# EAGLE design MainBoard (EAGLE 8.3.2)
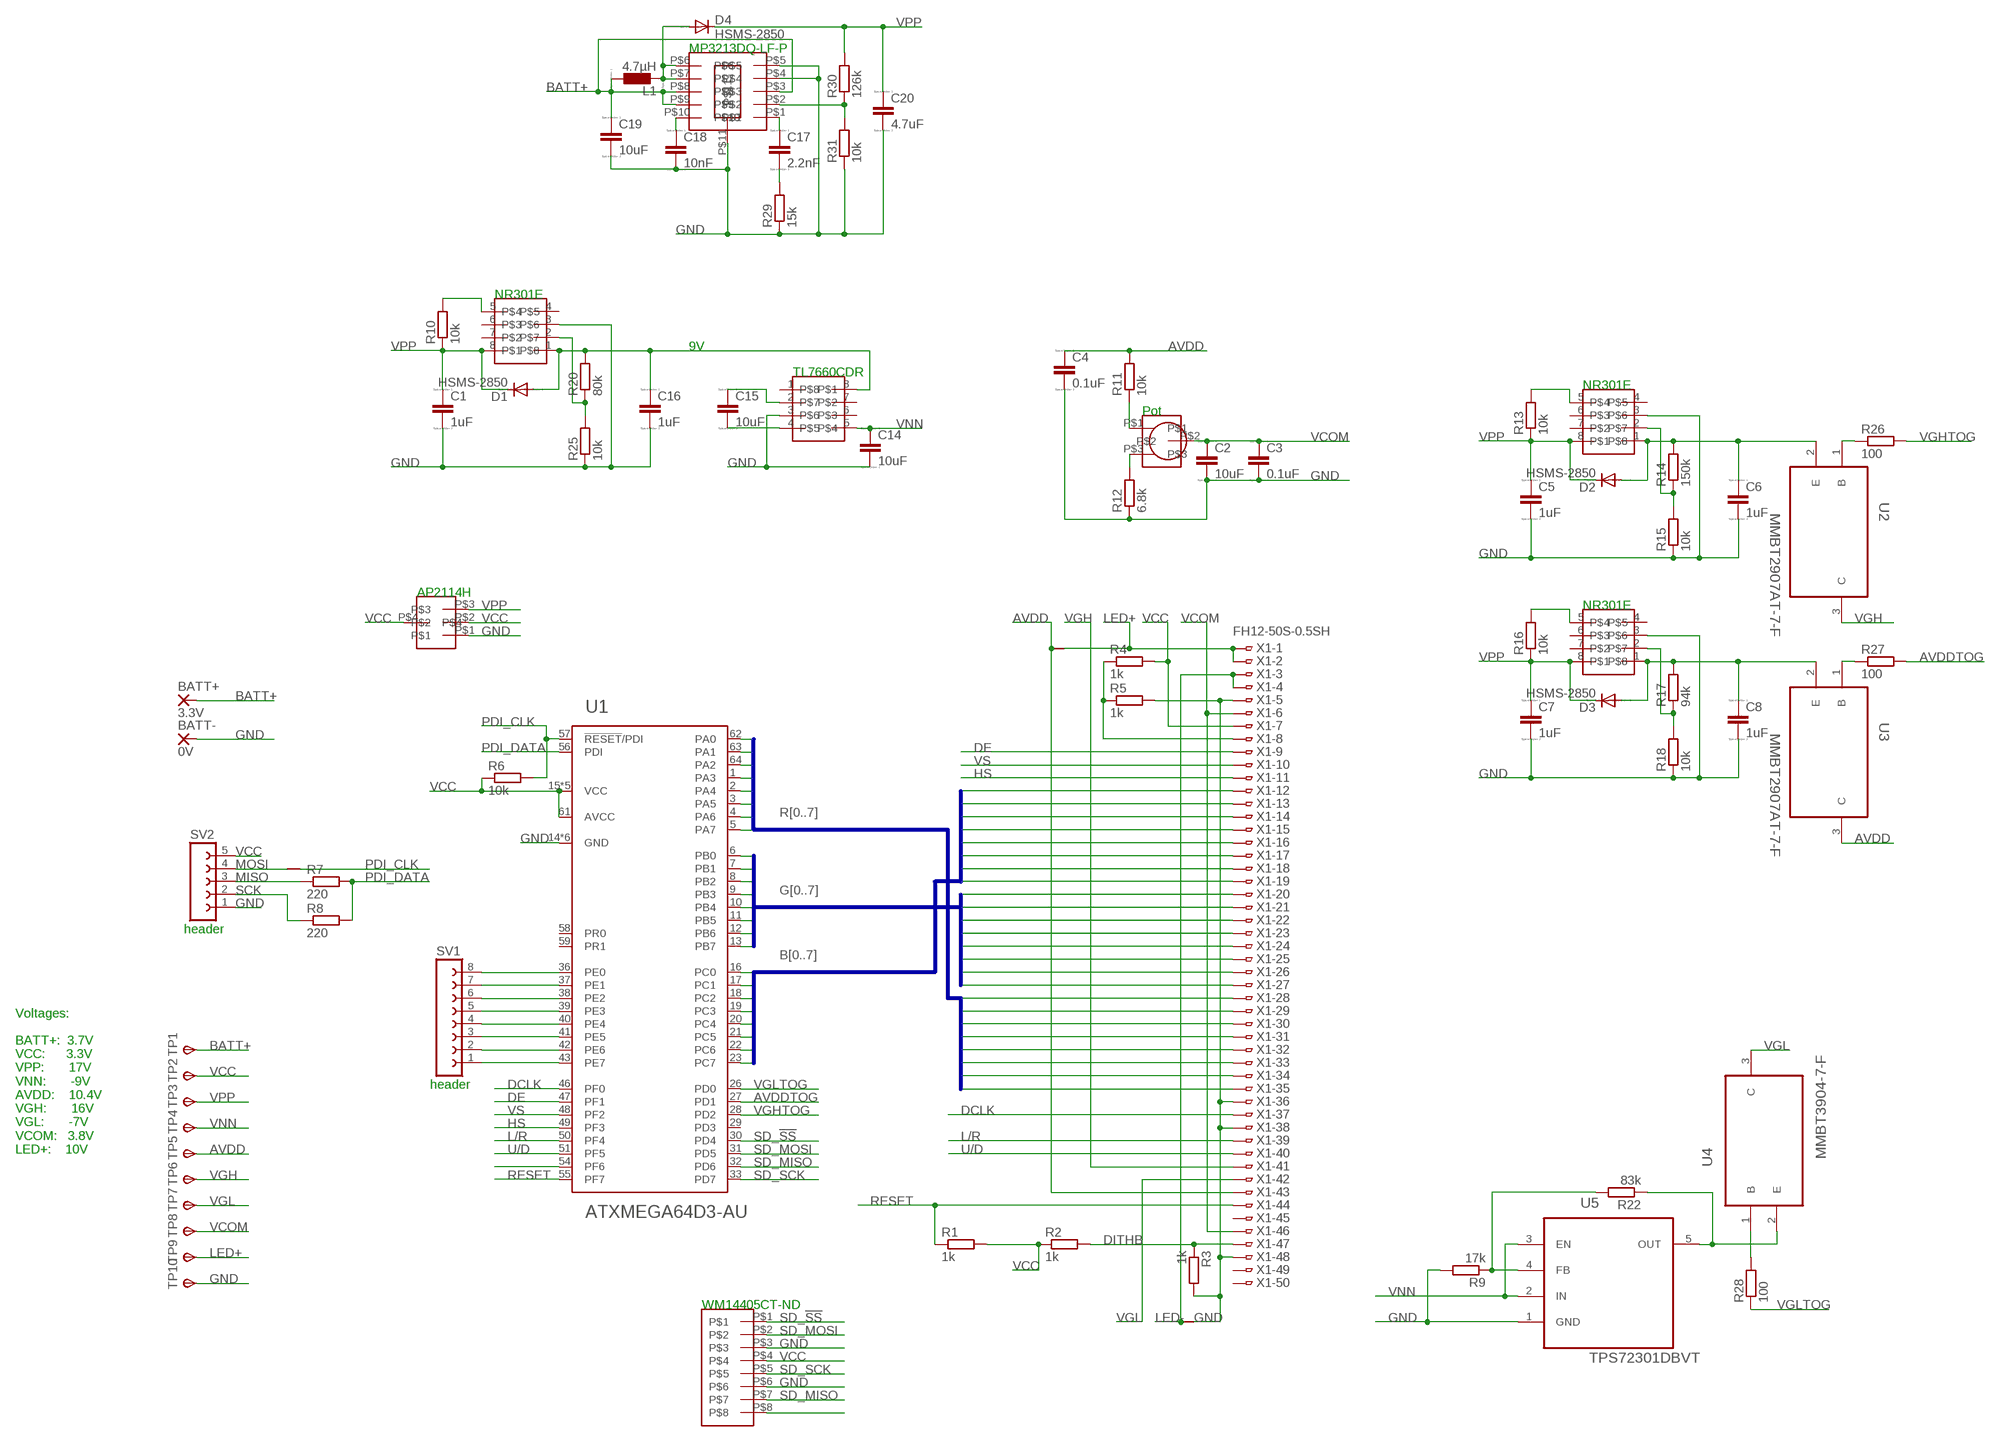
[diagram p0: schematic, sheet 1]

## Parts
AP2114H  AP2114H  [SOT233]
BATT+  3.3V  2,54/1,1  [2,54/1,1]
BATT-  0V  2,54/1,1  [2,54/1,1]
C1  1uF  CC0402  [C0402]
C2  10uF  CC0402  [C0402]
C3  0.1uF  CC0402  [C0402]
C4  0.1uF  CC0402  [C0402]
C5  1uF  CC0402  [C0402]
C6  1uF  CC0402  [C0402]
C7  1uF  CC0402  [C0402]
C8  1uF  CC0402  [C0402]
C14  10uF  CC0402  [C0402]
C15  10uF  CC0402  [C0402]
C16  1uF  CC0402  [C0402]
C17  2.2nF  CC0402  [C0402]
C18  10nF  CC0402  [C0402]
C19  10uF  CC0402  [C0402]
C20  4.7uF  CC0402  [C0402]
D1  HSMS-2850  [SOT23]
D2  HSMS-2850  [SOT23]
D3  HSMS-2850  [SOT23]
D4  HSMS-2850  [SOT23]
L1  4.7µH  L  [L1812]
R1  1k  R-EU_M1406  [M1406]
R2  1k  R-EU_M1406  [M1406]
R3  1k  R-EU_M1406  [M1406]
R4  1k  R-EU_M1406  [M1406]
R5  1k  R-EU_M1406  [M1406]
R6  10k  R-EU_M1406  [M1406]
R7  220  R-EU_M1406  [M1406]
R8  220  R-EU_M1406  [M1406]
R9  17k  R-EU_M1406  [M1406]
R10  10k  R-EU_M1406  [M1406]
R11  10k  R-EU_M1406  [M1406]
R12  6.8k  R-EU_M1406  [M1406]
R13  10k  R-EU_M1406  [M1406]
R14  150k  R-EU_M1406  [M1406]
R15  10k  R-EU_M1406  [M1406]
R16  10k  R-EU_M1406  [M1406]
R17  94k  R-EU_M1406  [M1406]
R18  10k  R-EU_M1406  [M1406]
R20  80k  R-EU_M1406  [M1406]
R22  83k  R-EU_M1406  [M1406]
R25  10k  R-EU_M1406  [M1406]
R26  100  R-EU_M1406  [M1406]
R27  100  R-EU_M1406  [M1406]
R28  100  R-EU_M1406  [M1406]
R29  15k  R-EU_M1406  [M1406]
R30  126k  R-EU_M1406  [M1406]
R31  10k  R-EU_M1406  [M1406]
SV1  FE08-1  [FE08]
SV2  FE05-1  [FE05-1]
TP1  TPSPAD1-17Y  [P1-17Y]
TP2  TPSPAD1-17Y  [P1-17Y]
TP3  TPSPAD1-17Y  [P1-17Y]
TP4  TPSPAD1-17Y  [P1-17Y]
TP5  TPSPAD1-17Y  [P1-17Y]
TP6  TPSPAD1-17Y  [P1-17Y]
TP7  TPSPAD1-17Y  [P1-17Y]
TP8  TPSPAD1-17Y  [P1-17Y]
TP9  TPSPAD1-17Y  [P1-17Y]
TP10  TPSPAD1-17Y  [P1-17Y]
U1  ATXMEGA64D3-AU  [TQFP-64A-64]
U2  MMBT2907AT-7-F  [SOT65P210X110-3N]
U3  MMBT2907AT-7-F  [SOT65P210X110-3N]
U4  MMBT3904-7-F  [SOT103P240X110-3N]
U5  TPS72301DBVT  [SOT95P280X145-5N]
U$1  SHORT  [SHORT]
U$2  MICROSD  [MICROSD]
U$4  TRIMMER  [TRIMMMER]
U$5  NR301E  SOIC-8  [SOIC-8]
U$6  NR301E  SOIC-8  [SOIC-8]
U$8  SHORT  [SHORT]
U$9  SHORT  [SHORT]
U$10  SOIC-8  [SOIC-8]
U$11  NR301E  SOIC-8  [SOIC-8]
U$12  QFN-10  [QFN-10]
X1  FH12-50S-0.5SH  [FH12-50S-0.5SH]

## Nets
AVDD: C4.1 R11.2 TP5.TP(PP) U3.3(C) U$8.P$1 X1.43
AVDDTOG: R27.2 U1.27(PD1)
B0: U1.16(PC0) X1.19
B1: U1.17(PC1) X1.18
B2: U1.18(PC2) X1.17
B3: U1.19(PC3) X1.16
B4: U1.20(PC4) X1.15
B5: U1.21(PC5) X1.14
B6: U1.22(PC6) X1.13
B7: U1.23(PC7) X1.12
BATT+: BATT+.1(P) C19.1 L1.1 TP1.TP(PP) U$12.P$3 U$12.P$8 U$12.P$9
DCLK: U1.46(PF0) X1.37
DE: U1.47(PF1) X1.9
DITHB: R2.2 R3.1 X1.47
G0: U1.6(PB0) X1.27
G1: U1.7(PB1) X1.26
G2: U1.8(PB2) X1.25
G3: U1.9(PB3) X1.24
G4: U1.10(PB4) X1.23
G5: U1.11(PB5) X1.22
G6: U1.12(PB6) X1.21
G7: U1.13(PB7) X1.20
GND: AP2114H.P$1 BATT-.1(P) C1.2 C2.2 C3.2 C4.2 C5.2 C6.2 C7.2 C8.2 C14.2 C16.2 C18.2 C19.2 C20.2 R3.2 R5.2 R9.2 R12.1 R15.1 R18.1 R25.1 R29.1 R31.1 SV2.1 TP10.TP(PP) U1.14(GND) U1.24(GND) U1.34(GND) U1.44(GND) U1.52(GND) U1.60(GND) U5.1(GND) U$2.P$3 U$2.P$6 U$5.3 U$6.3 U$9.P$2 U$10.3 U$11.3 U$12.P$4 U$12.P$5 U$12.P$11 X1.5 X1.36 X1.38 X1.48
HS: U1.49(PF3) X1.11
L/R: U1.50(PF4) X1.39
LED+: TP9.TP(PP) U$8.P$2 X1.1 X1.2
LED-: U$9.P$1 X1.3 X1.4
MISO: R7.1 SV2.3
MOSI: SV2.4 U$1.P$1
N$1: SV1.8 U1.36(PE0)
N$2: R14.1 R15.2 U$5.2
N$3: SV1.7 U1.37(PE1)
N$4: R11.1 U$4.P$1
N$5: SV1.6 U1.38(PE2)
N$6: R12.2 U$4.P$3
N$7: R4.1 R5.1 X1.8
N$8: U1.54(PF6)
N$9: R13.2 U$5.5
N$10: U$2.P$8
N$11: R17.1 R18.2 U$6.2
N$12: R16.2 U$6.5
N$14: C15.2 U$10.4
N$15: C15.1 U$10.2
N$16: SV1.5 U1.39(PE3)
N$19: R9.1 R22.2 U5.4(FB)
N$20: R22.1 U4.2(E) U5.5(OUT)
N$22: SV1.4 U1.40(PE4)
N$23: SV1.3 U1.41(PE5)
N$24: SV1.2 U1.42(PE6)
N$25: SV1.1 U1.43(PE7)
N$27: R20.1 R25.2 U$11.2
N$28: R10.2 U$11.5
N$29: C6.1 D2.1(A) R14.2 U2.2(E) U$5.1
N$30: C16.1 D1.1(A) R20.2 U$10.8 U$11.1
N$31: C8.1 D3.1(A) R17.2 U3.2(E) U$6.1
N$32: R26.1 U2.1(B)
N$33: R27.1 U3.1(B)
N$35: R28.2 U4.1(B)
N$36: C17.1 U$12.P$1
N$37: C17.2 R29.2
N$40: C18.1 U$12.P$10
N$41: D4.1(A) L1.2 U$12.P$6 U$12.P$7
N$42: R30.1 R31.2 U$12.P$2
PDI_CLK: R6.2 U1.57(!RESET!/PDI) U$1.P$2
PDI_DATA: R7.2 R8.2 U1.56(PDI)
R0: U1.62(PA0) X1.35
R1: U1.63(PA1) X1.34
R2: U1.64(PA2) X1.33
R3: U1.1(PA3) X1.32
R4: U1.2(PA4) X1.31
R5: U1.3(PA5) X1.30
R6: U1.4(PA6) X1.29
R7: U1.5(PA7) X1.28
RESET: R1.1 U1.55(PF7) X1.44
SCK: R8.1 SV2.2
SD_!SS: U1.30(PD4) U$2.P$1
SD_MISO: U1.32(PD6) U$2.P$7
SD_MOSI: U1.31(PD5) U$2.P$2
SD_SCK: U1.33(PD7) U$2.P$5
U/D: U1.51(PF5) X1.40
VCC: AP2114H.P$2 AP2114H.P$4 R1.2 R2.1 R4.2 R6.1 SV2.5 TP2.TP(PP) U1.15(VCC) U1.25(VCC) U1.35(VCC) U1.45(VCC) U1.53(VCC) U1.61(AVCC) U$2.P$4 X1.7
VCOM: C2.1 C3.1 TP8.TP(PP) U$4.P$2 X1.6 X1.46
VGH: TP6.TP(PP) U2.3(C) X1.41
VGHTOG: R26.2 U1.28(PD2)
VGL: TP7.TP(PP) U4.3(C) X1.42
VGLTOG: R28.1 U1.26(PD0)
VNN: C14.1 TP4.TP(PP) U5.2(IN) U5.3(EN) U$10.5
VPP: AP2114H.P$3 C1.1 C5.1 C7.1 C20.1 D1.3(C) D2.3(C) D3.3(C) D4.3(C) R10.1 R13.1 R16.1 R30.2 TP3.TP(PP) U$5.8 U$6.8 U$11.8
VS: U1.48(PF2) X1.10
Unconnected: U1.29(PD3) U1.58(PR0) U1.59(PR1) U$5.4 U$5.6 U$5.7 U$6.4 U$6.6 U$6.7 U$10.1 U$10.6 U$10.7 U$11.4 U$11.6 U$11.7 X1.45 X1.49 X1.50

## Buses
G[0..7]
B[0..7]
R[0..7]

## Notes on the sheet
- MP3213DQ-LF-P
- NR301E
- 9V
- TL7660CDR
- NR301E
- Pot
- AP2114H
- NR301E
- header
- header
- Voltages:
  
  BATT+:  3.7V
  VCC:      3.3V
  VPP:       17V
  VNN:       -9V
  AVDD:    10.4V
  VGH:       16V
  VGL:       -7V
  VCOM:   3.8V
  LED+:    10V
- WM14405CT-ND

## Library data of the parts
AP2114H = ElectronicBadge:AP2114H
BATT+ BATT- = wirepad:2,54/1,1: THROUGH-HOLE PAD
C1-C8 C14-C20 = eagle-ltspice:C: CAPACITOR, European symbol; SPICEMODEL: NONE; SPICEPREFIX: C
D1-D4 = avago:HSMS-2850: Surface Mount Microwave Schottky Detector Diodes Source: Data sheet <http://www.farnell.com/datasheets/461166.pdf>
L1 = eagle-ltspice:L: INDUCTOR, European symbol; SPICEMODEL: NONE; SPICEPREFIX: L
R1-R18 R20 R22 R25-R31 = resistor:R-EU_: RESISTOR, European symbol
SV1 = con-lsta:FE08-1: FEMALE HEADER; OC_FARNELL: unknown; OC_NEWARK: unknown
SV2 = con-lsta:FE05-1: FEMALE HEADER; OC_FARNELL: unknown; OC_NEWARK: unknown
TP1-TP10 = testpad:TPS: TEST PIN
U1 = atmel-xmega:ATXMEGA64D3: 8/16-bit XMEGA C3 Microcontroller Features High-performance, Low-power 8/16-bit Atmel® AVR® XMEGATM Microcontroller Non-volatile Program and Data Memories – 64K - 256K Bytes of In-System Self-Programmable Flash – 4K - 8K Bytes Boot Code Section with Independent Lock Bits – 2K - 4K Bytes EEPROM – 4K - 16K Bytes Internal SRAM Peripheral Features – Four-channel Event System – Five 16-bit Timer/Counters Four Timer/Counters with 4 Output Compare or Input Capture channels One Timer/Counters with 2 Output Compare or Input Capture channels High Resolution Extensions on two Timer/Counters Advanced Waveform Extension on one Timer/Counter – Three USARTs IrDA Extension on 1 USART – Two Two-Wire Interfaces with dual address match(I2C and SMBus compatible) – Two SPI (Serial Peripheral Interfaces) – 16-bit Real Time Counter with Separate Oscillator – One Sixteen-channel, 12-bit, 200ksps Analog to Digital Converter – Two Analog Comparators with Window compare function – External Interrupts on all General Purpose I/O pins – Programmable Watchdog Timer with Separate On-chip Ultra Low Power Oscillator Special Microcontroller Features – Power-on Reset and Programmable Brown-out Detection – Internal and External Clock Options with PLL – Programmable Multi-level Interrupt Controller – Sleep Modes: Idle, Power-down, Standby, Power-save, Extended Standby – Advanced Programming, Test and Debugging Interface PDI (Program and Debug Interface) for programming, test and debugging I/O and Packages – 50 Programmable I/O Lines – 64-lead TQFP – 64-pad QFN Operating Voltage – 1.6 – 3.6V Speed performance – 0 – 12 MHz @ 1.6 – 3.6V – 0 – 32 MHz @ 2.7 – 3.6V
U2 U3 = Diodes_Inc_By_element14_Batch_1:MMBT2907AT-7-F: TRANSISTOR; MPN: MMBT2907AT-7-F; OC_FARNELL: 1773614; OC_NEWARK: 51R6812; PACKAGE: SOT-523-3; SUPPLIER: Diodes Inc
U4 = Diodes_Inc_By_element14_Batch_1:MMBT3904-7-F: NPN SMALL SIGNAL SURFACE MOUNT TRANSISTOR; MPN: MMBT3906-7-F; OC_FARNELL: 1773602; OC_NEWARK: 51R6813; PACKAGE: SOT-23-3; SUPPLIER: DIODES INC.
U5 = Texas Instruments_By_element14_Batch_1:TPS72301DBVT: 200mA Low-Noise, High-PSRR Negative Output Low-Dropout Linear Regulators; MPN: TPS72301DBVT; OC_FARNELL: -; OC_NEWARK: 87H2931; PACKAGE: SOT-23-5; SUPPLIER: Texas Instruments
U$1 U$8 U$9 = ElectronicBadge:SHORT
U$2 = ElectronicBadge:MICROSD
U$4 = ElectronicBadge:TRIMMER
U$5 U$6 U$10 U$11 = smd-footprints:SOIC-8
U$12 = smd-footprints:QFN-10
X1 = con-hirose:FH12-50S-0.5S: 0.5mm Pitch Connectors For FPC/FFC Source: Data sheet <http://www.hirose.co.jp/cataloge_hp/e58605370.pdf>; MPN: FH12-50S-0.5SH(55); OC_FARNELL: 1324557; OC_NEWARK: 34M6181

## Net classes
0 default: clearance 0.205 mm

## Board
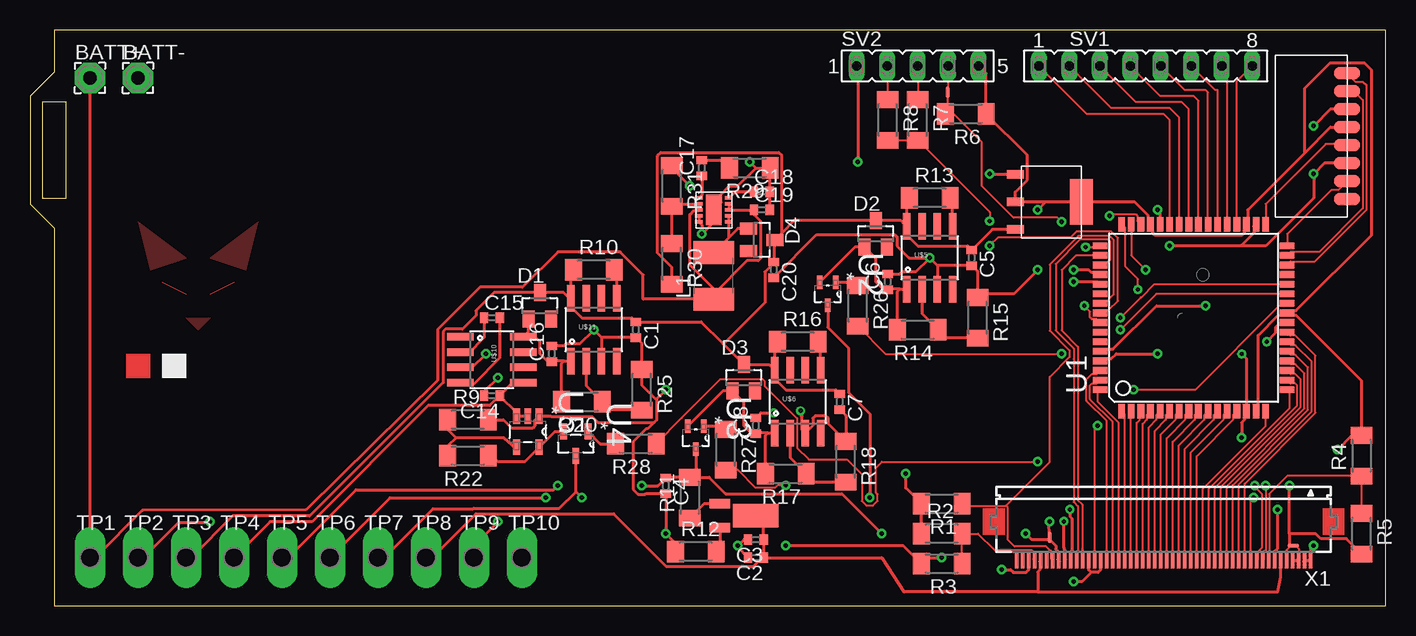
[diagram p1: board, top side]
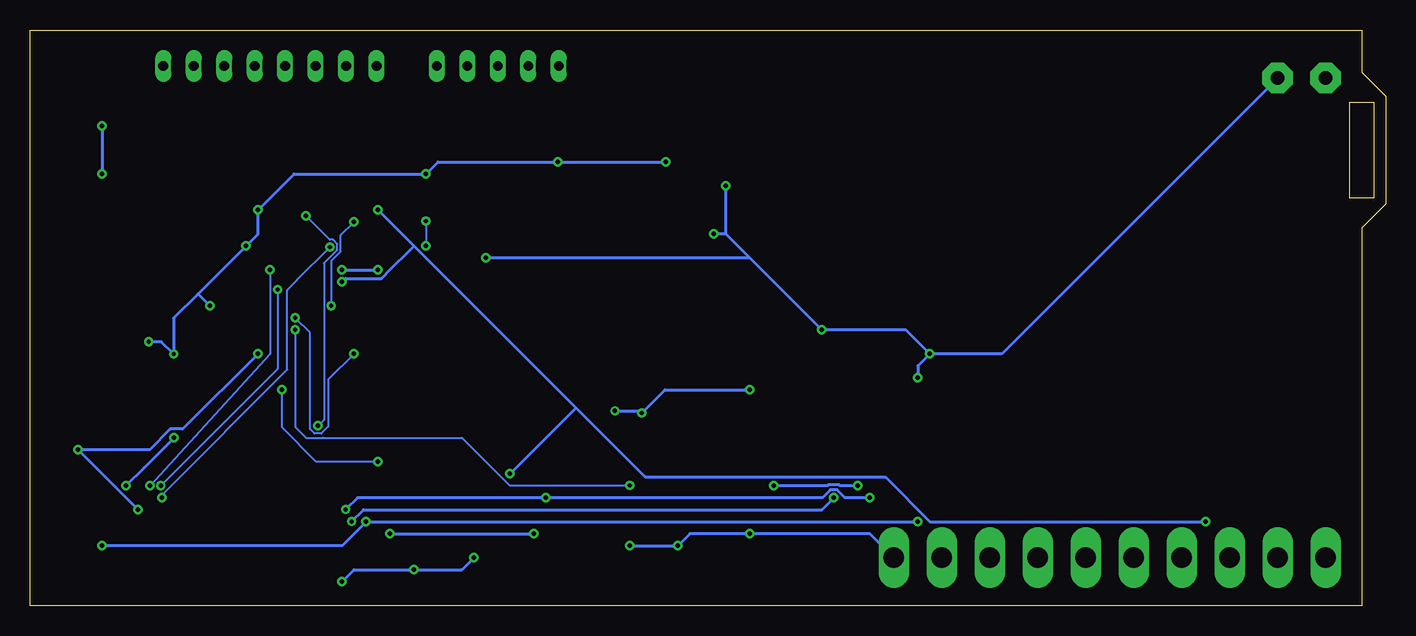
[diagram p2: board, bottom side, seen from below]

Size 113 x 48 mm. Coordinates in mm from the lower left corner, seen from the top.
Outline: 2,0 113,0 113,48 2,48 2,44.5 0,42.5 0,33.5 2,31.5 2,0
Outline: 1,42 1,34 3,34 3,42 1,42
Copper layers (1*16): Top 0.035mm / dielectric 1.5mm / Bottom 0.035mm
Design rules "default *": minimum track width 6mil, minimum drill 0.35mm, track to track 2mil, track to pad 2mil, pad to pad 2mil, via to via 2mil, smd to smd 2mil, copper to edge 40mil, drill to drill 6mil, minimum pad ring 10mil, minimum via ring 8mil, stop-mask expansion 4mil, vias tented up to drill 0mil, thermal gap 10mil

### Footprints (pad centres in the part's own frame; a part is rotated, then mirrored left to right if it is on the bottom)
SOT233 = smd 0.711 x 1.422: P$1 -2.3,-4.5; P$2 0,-4.5; P$3 2.3,-4.5 | smd 3.81 x 1.93: P$4 0,1
2,54/1,1 = drill 1.118 pad 2.54 octagon: 1 0,0
C0402 = smd 0.7 x 0.9: 1 -0.65,0; 2 0.65,0
SOT23 = smd 1 x 1.4: 1 -0.95,-1.1; 2 0.95,-1.1; 3 0,1.1
L1812 = smd 1.9 x 3.4: 1 -1.95,0; 2 1.95,0
M1406 = smd 1.4 x 1.8: 1 -1.7,0; 2 1.7,0
FE08 = drill 0.813 long: 1 -8.89,0; 2 -6.35,0; 3 -3.81,0; 4 -1.27,0; 5 1.27,0; 6 3.81,0; 7 6.35,0; 8 8.89,0
FE05-1 = drill 0.813 long: 1 -5.08,0; 2 -2.54,0; 3 0,0; 4 2.54,0; 5 5.08,0
P1-17Y = drill 1.702 pad 2.121 long: TP 0,0
TQFP-64A-64 = smd 1.194 x 0.559: 1 -7.8,6; 2 -7.8,5.2; 3 -7.8,4.4; 4 -7.8,3.6; 5 -7.8,2.8; 6 -7.8,2; 7 -7.8,1.2; 8 -7.8,0.4; 9 -7.8,-0.4; 10 -7.8,-1.2; 11 -7.8,-2; 12 -7.8,-2.8; 13 -7.8,-3.6; 14 -7.8,-4.4; 15 -7.8,-5.2; 16 -7.8,-6; 33 7.8,-6; 34 7.8,-5.2; 35 7.8,-4.4; 36 7.8,-3.6; 37 7.8,-2.8; 38 7.8,-2; 39 7.8,-1.2; 40 7.8,-0.4; 41 7.8,0.4; 42 7.8,1.2; 43 7.8,2; 44 7.8,2.8; 45 7.8,3.6; 46 7.8,4.4; 47 7.8,5.2; 48 7.8,6 | smd 0.559 x 1.194: 17 -6,-7.8; 18 -5.2,-7.8; 19 -4.4,-7.8; 20 -3.6,-7.8; 21 -2.8,-7.8; 22 -2,-7.8; 23 -1.2,-7.8; 24 -0.4,-7.8; 25 0.4,-7.8; 26 1.2,-7.8; 27 2,-7.8; 28 2.8,-7.8; 29 3.6,-7.8; 30 4.4,-7.8; 31 5.2,-7.8; 32 6,-7.8; 49 6,7.8; 50 5.2,7.8; 51 4.4,7.8; 52 3.6,7.8; 53 2.8,7.8; 54 2,7.8; 55 1.2,7.8; 56 0.4,7.8; 57 -0.4,7.8; 58 -1.2,7.8; 59 -2,7.8; 60 -2.8,7.8; 61 -3.6,7.8; 62 -4.4,7.8; 63 -5.2,7.8; 64 -6,7.8
SOT65P210X110-3N = smd 1.118 x 0.457: 1 -0.965,0.66; 2 -0.965,-0.66; 3 0.965,0
SOT103P240X110-3N = smd 1.321 x 0.559: 1 -1.016,1.016; 2 -1.016,-1.016; 3 1.016,0
SOT95P280X145-5N = smd 1.27 x 0.559: 1 -1.295,0.94; 2 -1.295,0; 3 -1.295,-0.94; 4 1.295,-0.94; 5 1.295,0.94
SHORT = smd 0.61 x 0.305: P$1 0,0; P$2 0.389,0
MICROSD = smd 1.067 x 2.184: P$1 0,0; P$2 1.5,0; P$3 3,0; P$4 4.5,0; P$5 6,0; P$6 7.5,0; P$7 9,0; P$8 10.5,0
TRIMMMER = smd 0.813 x 1.676: P$1 -1,-2.5; P$3 1,-2.5 | smd 1.93 x 3.81: P$2 0,0.5
SOIC-8 = smd 0.61 x 2.21: 1 -1.905,-2.616; 2 -0.635,-2.616; 3 0.635,-2.616; 4 1.905,-2.616; 5 1.905,2.616; 6 0.635,2.616; 7 -0.635,2.616; 8 -1.905,2.616
QFN-10 = smd 0.61 x 0.305: P$1 -1.25,1; P$2 -1.25,0.5; P$3 -1.25,0; P$4 -1.25,-0.5; P$5 -1.25,-1; P$6 1.25,-1; P$7 1.25,-0.5; P$8 1.25,0; P$9 1.25,0.5; P$10 1.25,1 | smd 1.27 x 2.54: P$11 0,0
FH12-50S-0.5SH = smd 0.3 x 1.3: 1 -12.25,3.25; 2 -11.75,3.25; 3 -11.25,3.25; 4 -10.75,3.25; 5 -10.25,3.25; 6 -9.75,3.25; 7 -9.25,3.25; 8 -8.75,3.25; 9 -8.25,3.25; 10 -7.75,3.25; 11 -7.25,3.25; 12 -6.75,3.25; 13 -6.25,3.25; 14 -5.75,3.25; 15 -5.25,3.25; 16 -4.75,3.25; 17 -4.25,3.25; 18 -3.75,3.25; 19 -3.25,3.25; 20 -2.75,3.25; 21 -2.25,3.25; 22 -1.75,3.25; 23 -1.25,3.25; 24 -0.75,3.25; 25 -0.25,3.25; 26 0.25,3.25; 27 0.75,3.25; 28 1.25,3.25; 29 1.75,3.25; 30 2.25,3.25; 31 2.75,3.25; 32 3.25,3.25; 33 3.75,3.25; 34 4.25,3.25; 35 4.75,3.25; 36 5.25,3.25; 37 5.75,3.25; 38 6.25,3.25; 39 6.75,3.25; 40 7.25,3.25; 41 7.75,3.25; 42 8.25,3.25; 43 8.75,3.25; 44 9.25,3.25; 45 9.75,3.25; 46 10.25,3.25; 47 10.75,3.25; 48 11.25,3.25; 49 11.75,3.25; 50 12.25,3.25

### Placement (x,y rotation side)
AP2114H  86.64,33.66 270 top
BATT+  5,44 0 top
BATT-  9,44 0 top
C1  50.5,23 270 top
C2  60.5,4 180 top
C3  60.5,5.5 180 top
C4  53,10 270 top
C5  78.5,29 270 top
C6  71.5,27 90 top
C7  67.5,17 270 top
C8  60.5,15 90 top
C14  38.5,17.5 180 top
C15  38.5,24 0 top
C16  43.5,21 90 top
C17  56,36.5 90 top
C18  61,34.5 0 top
C19  61,33 0 top
C20  62,28 270 top
D1  42.5,25 0 top
D2  70.5,31 0 top
D3  59.5,19 0 top
D4  61,30.5 270 top
L1  57,27.5 90 top
R1  76,8.5 180 top
R2  76,6 0 top
R3  76,3.5 180 top
R4  111,12.5 90 top
R5  111,6 270 top
R6  78,41 180 top
R7  74,40.5 270 top
R8  71.5,40.5 270 top
R9  36.5,15.5 0 top
R10  47,28 0 top
R11  55,9 90 top
R12  55.5,4.5 0 top
R13  75,34 0 top
R14  74,23 180 top
R15  79,24 270 top
R16  64,22 0 top
R17  63,11 180 top
R18  68,12 270 top
R20  46,17 180 top
R22  36.5,12.5 180 top
R25  51,18 270 top
R26  69,25 270 top
R27  58,13 270 top
R28  50.5,13.5 180 top
R29  60,36.5 180 top
R30  53.5,28.5 270 top
R31  53.5,35 270 top
SV1  93,45 0 top
SV2  74,45 0 top
TP1  5,4 0 top
TP2  9,4 0 top
TP3  13,4 0 top
TP4  17,4 0 top
TP5  21,4 0 top
TP6  25,4 0 top
TP7  29,4 0 top
TP8  33,4 0 top
TP9  37,4 0 top
TP10  41,4 0 top
U1  97,24 90 top
U2  66.5,26 270 top
U3  55.5,14 270 top
U4  45.5,13.5 270 top
U5  41.5,14.5 270 top
U$1  76.5,43 270 top
U$2  109.8,44.4 270 top
U$4  60,7.5 270 top
U$5  75,29 0 top
U$6  64,17 0 top
U$8  85,5.5 90 top
U$9  105.5,5 180 top
U$10  38.5,20.5 270 top
U$11  47,23 0 top
U$12  57,33 0 top
X1  94.5,7 180 top

### Tracks (layer width: path | path; a pad name or v marks a point on that pad's centre or on a via)
AVDD  (via drill 0.35)
  Top 0.254: U3.3 55.5,11.2 R11.2 | R11.2 53.05,10.7 C4.1 52.35,10 v51,10 | 85.82,3.68 X1.43 85.68,3.82 85.68,4.52 85.5,4.7 85.5,5 U$8.P$1 83.5,5.5 v83,6 | TP5.TP 21.52,4 27.18,9.66 43.66,9.66 v44,10 | v71,6 67.68,9.32 57.98,9.32 56.6,10.7 R11.2
  Bottom 0.254: v44,10 45.49,10 45.56,10.06 46.44,10.06 46.51,10 v51,10 | v83,6 v71,6
AVDDTOG  (via drill 0.35)
  Top 0.152: U1.27 93.89,26 v90.89,23 | v63,10.03 62.33,10.03 62.12,9.82 60.48,9.82 59,11.3 R27.2
  Bottom 0.152: v90.89,23 90.89,14.89 89.98,13.98 88.58,13.98 88.56,14 77,14 73.03,10.03 v63,10.03
B0
  Top 0.152: X1.19 97.75,9.75 103,15 U1.16
B1
  Top 0.152: X1.18 98.25,9.75 105,16.5 105,17.8 U1.17
B2
  Top 0.152: X1.17 98.75,9.82 105.63,16.69 105.63,18.37 105.49,18.51 105.09,18.51 U1.18
B3
  Top 0.152: X1.16 99.25,9.89 105.93,16.57 105.93,18.87 105.49,19.31 105.09,19.31 U1.19
B4
  Top 0.152: X1.15 99.75,9.96 106.23,16.44 106.23,19.36 105.49,20.11 105.09,20.11 U1.20
B5
  Top 0.152: X1.14 100.25,10.03 106.54,16.32 106.54,19.86 105.49,20.91 105.09,20.91 U1.21
B6
  Top 0.152: X1.13 100.75,10.1 106.84,16.19 106.84,20.36 105.49,21.71 105.09,21.71 U1.22
B7
  Top 0.152: X1.12 101.25,10.16 107.15,16.06 107.15,20.85 105.49,22.51 105.09,22.51 U1.23
BATT+
  Top 0.254: 57,26 L1.1 51.11,25.55 51.11,27.58 49.2,29.5 44,29.5 41.06,26.56 37.51,26.56 33.99,23.04 33.99,18.79 23,8 9.37,7.92 5.45,4 TP1.TP BATT+.1 | 57,26 57,26.41 55.02,28.38 55.02,32.62 55.33,32.93 55.68,32.93 U$12.P$3 | U$12.P$9 U$12.P$8 C19.1 60.35,32.59 60.88,32.07 60.88,28.93 60.72,28.77 59.77,28.77 57,26
DCLK  (via drill 0.35)
  Top 0.152: X1.37 88.75,14.75 v89,15 | v90,32.5 | v90,32.5 90.13,32.62 92.17,32.62 92.31,32.49 92.31,32.09 U1.46
  Bottom 0.152: v90,32.5 88.01,30.51 87.75,30.51 87.39,30.15 87.39,29.65 88.5,28.54 88.5,15.5 v89,15
DE  (via drill 0.35)
  Top 0.152: U1.47 91.8,29.2 v93,28 | v103,10 103,4.62 102.87,4.5 102.87,3.87 X1.9
  Bottom 0.152: v93,28 93,21 v103,10
DITHB
  Top 0.152: R3.1 R2.2 79.03,6 80.4,4.63 83.5,4.63 83.63,4.5 83.63,3.87 X1.47
G0
  Top 0.152: U1.6 94.71,15.91 94.71,15.51 93.75,14.55 X1.27
G1
  Top 0.152: U1.7 95.51,15.91 95.51,15.51 94.25,14.25 X1.26
G2
  Top 0.152: U1.8 96.31,15.91 96.31,15.51 94.75,13.95 X1.25
G3
  Top 0.152: U1.9 97.11,15.91 97.11,15.51 95.25,13.65 X1.24
G4
  Top 0.152: U1.10 97.91,15.91 97.91,15.51 95.75,13.35 X1.23
G5
  Top 0.152: U1.11 98.71,15.91 98.71,15.51 96.25,13.05 X1.22
G6
  Top 0.152: U1.12 99.51,15.91 99.51,15.51 96.75,12.75 X1.21
G7
  Top 0.152: U1.13 100.31,15.91 100.31,15.51 97.25,12.45 X1.20
GND  (via drill 0.35)
  Top 0.152: U$9.P$2 104.75,4.64 X1.5
  Top 0.254: v38,21 36.87,19.86 U$10.3 | C16.2 44.48,21.65 44.65,21.82 45.82,21.82 v47,23 47.63,22.36 | 47.63,22.36 U$11.3 | 47.63,22.36 50.48,22.36 C1.2 51,21.85 R25.1 51,18.37 52.23,17.14 | v39,19 37.85,17.85 C14.2 | R9.2 39.47,15.5 40.14,14.83 41.92,14.83 42.11,15.02 42.11,15.47 U5.1 43.44,15.79 43.46,15.77 46.86,15.77 47.36,15.27 52,15.27 | 52.23,17.14 52.23,15.46 52.04,15.27 52,15.27 | 60.5,36.5 58.96,34.96 58.28,34.96 57.61,34.29 57.61,33.61 U$12.P$11 57,32 v56,31 56,31.75 U$12.P$5 U$12.P$4 | 60.5,36.5 R29.1 61.65,36.45 C18.2 C19.2 | v55,35 53.5,36.5 R31.1 | v75,29 75.64,28.36 | 75.64,28.36 U$5.3 | C6.2 72.48,27.65 72.65,27.82 73.82,27.82 v75,29 | 75.64,28.36 78.48,28.36 C5.2 79,27.85 79,26 | 79,26 R15.1 | C20.2 65.58,30.93 72.09,30.93 72.28,30.74 72.28,30 73.28,29 v75,29 | v101,14 101,15.25 101.21,15.47 101.21,16.01 U1.14 101.4,20.6 v101.03,20.97 | U$9.P$2 105,5.11 105,6 | 105,6 v105,10 | R5.2 109.73,5.57 107.61,5.57 107.18,6 105,6 | U1.34 102.01,31.61 102.01,31.07 100.97,30.03 | 100.97,30.03 100.95,30 v95,30 | v94,33 94.2,32.8 U1.44 | v103.1,22 103.87,22.77 103.87,23.22 104.25,23.6 U1.24 | U1.52 89.01,27.79 88.47,27.79 88.25,28 v87,28 | v84,28 82,26 79,26 | U1.60 89.39,21.39 90.29,21.39 93.9,25 v98,25 | v80,36 80.04,35.96 AP2114H.P$1 | v60,37 60.5,36.5 | SV2.1 69,44.92 v69,37 | C7.2 68,15.85 R18.1 66.54,15.16 66.54,15.63 66.35,15.82 65.46,15.82 65.27,15.63 65.27,15.02 U$6.3 64.36,14.66 64.36,15.77 64.24,15.89 v64.24,16.24 | C8.2 60.92,16.07 v62,16.07 | v53,18 52.23,17.23 52.23,17.14 | v76,4 74.8,4 R3.2 72.8,5 v63,5 | v81,3 81.73,3 81.96,2.77 83.04,2.77 83.23,2.96 83.23,3.69 83.25,3.71 X1.48
  Top 0.254: 88.46,2.77 89.04,2.77 89.23,2.96 89.23,3.73 X1.36 | 88.46,2.77 88.27,2.96 88.27,3.73 X1.38 | 88.46,2.77 87.69,2 v87,2 | C3.2 59.5,5.5 v59,5 59,4.85 C2.2 | R12.1 53.8,5.2 v53,6 C4.2 51.35,9.35 51.29,9.29 50.71,9.29 50.29,9.71 50.29,13.66 51.36,14.73 51.46,14.73 52,15.27 | U$2.P$3 108.4,41.4 v107,40 | U$2.P$6 108,36.9 | 108,36.9 107.9,36.9 | 100.97,30.03 101,30 103,30 107,34 v107,36 107.9,36.9 | 108,36.9 107.9,36.9
  Bottom 0.254: BATT-.1 32,21 v38,21 | v38,21 40,23 v47,23 53,29 | v38,21 39,20 v39,19 | 53,29 55,31 | 55,31 v56,31 | 55,31 v55,35 | 53,29 v75,29 | 103.5,11.5 v101,14 | 103.5,11.5 v105,10 | 103.52,11.5 103.5,11.5 | 99,26 v95,30 94,31 v94,33 91,36 v80,36 79,37 v69,37 v60,37 | 99,26 101.03,23.97 v101.03,20.97 102.06,22 v103.1,22 | v87,28 v84,28 | v98,25 99,26 | v53,18 60.07,18 v62,16.07 62.17,16.24 v64.24,16.24 | v76,4 77,3 v81,3 86,3 v87,2 | v63,5 v59,5 58,6 v53,6 43,6 TP10.TP | v107,40 v107,36
HS  (via drill 0.35)
  Top 0.152: X1.11 101.75,8.75 v102,9 | v88,29.9 89.1,29.9 U1.49
  Bottom 0.152: v102,9 102,9.23 91.55,19.68 91.55,26.3 90.75,27.11 90.75,27.15 v88,29.9
L/R
  Top 0.152: U1.50 87.2,29.2 86,28 86,22.94 87.37,21.57 87.37,8.77 87.72,8.43 87.72,4.7 87.74,4.62 87.72,4.56 87.72,3.79 X1.39
LED+  (via drill 0.35)
  Top 0.254: 106.18,3.68 X1.2 X1.1 106.75,4.75 v107,5 | U$8.P$2 84.89,6.89 v85,7 | v39,7 37,5 TP9.TP
  Bottom 0.254: v107,5 87,5 v85,7 v39,7
LED-
  Top 0.152: U$9.P$1 105.75,4.75 X1.3
  Top 0.254: X1.3 X1.4
MISO
  Top 0.152: SV2.3 R7.1
MOSI
  Top 0.152: SV2.4 76.54,43.04 U$1.P$1
N$1
  Top 0.152: U1.36 100.6,43.71 SV1.8
N$2
  Top 0.254: R15.2 76.4,22.3 R14.1 74.36,24.34 U$5.2
N$3
  Top 0.152: U1.37 99.8,44.55 SV1.7
N$4
  Top 0.254: U$4.P$1 56.2,8.5 R11.1
N$5
  Top 0.152: U1.38 99,43 98.81,43 SV1.6
N$6
  Top 0.254: U$4.P$3 57.5,4.8 R12.2
N$7
  Top 0.152: X1.8 103.31,3.8 103.31,9.3 104.8,10.8 R4.1 R5.1
N$9
  Top 0.254: U$5.5 76.91,33.8 R13.2
N$11
  Top 0.254: U$6.2 63.37,12.34 R17.1 65.4,10.3 R18.2
N$12
  Top 0.254: U$6.5 65.91,21.8 R16.2
N$13
  pour Top: 9,32 10,28 13,29
N$14
  Top 0.254: C15.2 39.15,20.65 37,18.5 35.98,18.5 U$10.4
N$15
  Top 0.254: C15.1 37.85,22.35 36.5,21 36.02,21 U$10.2
N$16
  Top 0.152: U1.39 98.2,42.8 98,43 96.27,43 SV1.5
N$17
  pour Top: 15,29 18,28 19,32
N$18
  Top 0.076: 11,27 13,26
N$19
  Top 0.254: U5.4 40.56,13.06 39.5,14 35.5,14 | 35.5,14 34.8,14.7 R9.1 | 35.5,14 34.8,13.3 R22.2
N$20
  Top 0.254: U4.2 43.75,14.52 U5.5 41.23,12 39,12 38.5,12.5 R22.1
N$21
  Top 0.076: 15,26 17,27
N$22
  Top 0.152: U1.40 97.4,42.1 97,42.5 94.23,42.5 SV1.4
N$23
  Top 0.152: U1.41 96.6,41.4 96,42 92.19,42 SV1.3
N$24
  Top 0.152: U1.42 95.8,40.7 95,41.5 90.15,41.5 SV1.2
N$25
  Top 0.152: U1.43 95,40.5 94.5,41 88.11,41 SV1.1
N$26
  pour Top: 13,24 15,24 14,23
N$27
  Top 0.254: U$11.2 46.37,18.34 R20.1 48.4,16.3 R25.2
N$28
  Top 0.254: R10.2 48.91,27.8 U$11.5
N$29
  Top 0.254: U2.2 68.77,29.9 D2.1 70.5,28.95 70.5,27 71.15,26.35 C6.1 71.53,26.38 72.5,26.38 | 72.5,26.38 U$5.1 | R14.2 72.3,26.18 72.5,26.38
N$30
  Top 0.254: 44.5,20.38 U$11.1 | 44.5,20.38 43.53,20.38 C16.1 43.15,20.35 42.5,21 42.5,21.56 42.5,22 42.09,22.41 U$10.8 41.55,22.84 D1.1 | R20.2 44.3,20.18 44.5,20.38
N$31
  Top 0.254: 61.5,14.38 U$6.1 | 61.5,14.38 60.53,14.38 C8.1 60.15,14.35 59.5,15 59.5,16.95 D3.1 57.77,17.9 U3.2 | R17.2 61.3,14.18 61.5,14.38
N$32
  Top 0.254: U2.1 68.73,26.96 R26.1
N$33
  Top 0.254: U3.1 57.73,14.96 R27.1
N$35
  Top 0.254: U4.1 47.53,13.5 R28.2
N$36
  Top 0.254: C17.1 56,34.25 U$12.P$1
N$37
  Top 0.254: C17.2 57.65,37.15 R29.2
N$40
  Top 0.254: C18.1 58.75,34.5 U$12.P$10
N$41
  Top 0.254: U$12.P$7 U$12.P$6 58.25,30.7 | L1.2 58.25,30.7 | D4.1 59,31.45 58.25,30.7
N$42
  Top 0.254: U$12.P$2 53.7,33.5 R31.2 R30.1
PDI_CLK  (via drill 0.35)
  Top 0.152: U$1.P$2 76.5,41.2 R6.2 | v87.89,25 88.37,24.52 88.37,24.03 88.51,23.89 88.91,23.89 U1.57 | 76.52,40.78 R6.2 | v86,32 85.66,32.34 82,32.34 79.34,34.99 79.34,38.66 77,41 R6.2
  Bottom 0.152: v86,32 87.09,30.91 87.09,29.52 87.89,28.72 v87.89,25
PDI_DATA  (via drill 0.35)
  Top 0.152: R8.2 R7.2 | R7.2 74.8,38.8 | R7.2 80,32.8 v80,32.07 | v80,30 80.72,30.72 86.79,30.72 87.23,31.17 90.17,31.17 90.69,30.65 90.69,25.41 89.91,24.64 89.44,24.64 U1.56
  Bottom 0.152: v80,32.07 v80,30
R0
  Top 0.152: X1.35 89.75,15.39 88.07,17.07 88.07,18.87 88.51,19.31 88.91,19.31 U1.62
R1
  Top 0.152: X1.34 90.25,15.32 88.37,17.19 88.37,18.37 88.51,18.51 88.91,18.51 U1.63
R2
  Top 0.152: X1.33 90.75,15.25 89,17 89,17.8 U1.64
R3
  Top 0.152: X1.32 91.25,15.95 U1.1
R4
  Top 0.152: X1.31 91.75,16.15 U1.2
R5
  Top 0.152: X1.30 92.25,15.25 92.5,15.5 92.5,16.1 U1.3
R6
  Top 0.152: X1.29 92.75,15.15 93.11,15.51 93.11,15.91 U1.4
R7
  Top 0.152: U1.5 93.91,15.91 93.91,15.51 93.25,14.85 X1.28
RESET
  Top 0.152: X1.44 85.13,3.87 85.13,4.54 85.08,4.54 84.69,4.93 82.07,4.93 81.5,5.5 81.5,8.17 81.34,8.33 | R1.1 77.87,8.33 81.34,8.33 | U1.55 89.6,25.2 90.33,25.93 90.33,30.5 90.02,30.81 87.38,30.81 85,28.43 85,22.93 86.66,21.27 86.66,20.73 85,19.07 85,11.98 81.34,8.33
SCK
  Top 0.152: SV2.2 71.46,42.24 R8.1
SD_!SS
  Top 0.152: U1.30 105.09,28.69 107.11,28.69 111.43,33.01 111.43,43.36 111.12,43.66 110.54,43.66 U$2.P$1
SD_MISO
  Top 0.152: U$2.P$7 109.06,34.66 108.48,34.66 104.8,30.98 U1.32
SD_MOSI
  Top 0.152: U$2.P$2 110.38,42.9 111.12,42.16 111.12,33.14 107.47,29.49 105.09,29.49 U1.31
SD_SCK
  Top 0.152: U$2.P$5 109.7,38.5 108,38.5 103,33.5 U1.33
U/D
  Top 0.152: U1.51 89.6,28.4 90.03,28.83 90.03,30.37 89.89,30.51 87.51,30.51 85.5,28.5 85.5,22.94 87.02,21.42 87.02,20.58 87,20.56 87,8.63 87.36,8.28 87.36,4.64 87.25,4.4 X1.40
VCC  (via drill 0.35)
  Top 0.254: AP2114H.P$2 82.14,34.5 83.13,35.49 83.13,37.57 R6.1 79.7,44.38 SV2.5 | U$2.P$4 108.4,39.9 106.25,37.75 | 106.25,37.75 101.5,33 101.5,31.9 U1.35 101.21,31.61 101.21,31.07 101.02,30.87 93.78,30.87 93.59,31.07 93.59,31.61 U1.45 93.21,31.99 93.21,32.53 92.09,33.66 AP2114H.P$4 84.66,33.66 | 82,33.52 AP2114H.P$2 | 84.66,33.66 v84,33 | v15,7 14.88,6.88 12.33,6.88 9.45,4 TP2.TP | U1.25 104.99,24.59 105.53,24.59 111.83,30.89 111.83,44.66 111.22,45.27 108.38,45.27 106.25,43.14 106.25,37.75 | U1.15 102.39,16.39 102.39,22.53 104.07,24.21 104.61,24.21 U1.25 | U1.25 104.99,24.21 105.53,24.21 111,18.75 R4.2 110.2,14.2 v109,13 | X1.7 103.77,3.77 103.77,4.54 104,4.77 v104,8 | U1.53 89.01,26.99 88.47,26.99 88.45,27 v87,27 | U1.61 89.39,20.59 90.14,20.59 90.55,21 v94,21 | R2.1 R1.2 73,9.8 v73,11 | 84.66,33.66 AP2114H.P$2
  Bottom 0.254: v15,7 38,7 41.71,10.71 61.71,10.71 67.5,16.5 | 81,30 v84,33 | 67.5,16.5 81,30 | v104,8 v109,13 103,13 101.29,14.71 100.29,14.71 v94,21 | v87,27 86.71,27.29 83.71,27.29 83.29,27.71 81,30 | v73,11 67.5,16.5
VCOM
  Top 0.254: U$4.P$2 61.15,6.85 C3.1 C2.1 | TP8.TP 33.52,4 37.18,7.66 48.65,7.66 53.03,3.27 60.32,3.27 61.05,4 C2.1 | C2.1 71,4 72.86,1.14 84,1.14 | X1.6 104.25,2.39 104,1.14 84,1.14 | X1.46 84.18,3.68 84.18,2.98 84,2.81 84,1.14
VGH  (via drill 0.35)
  Top 0.254: TP6.TP 30,9 v43,9 | U2.3 66.5,23.2 68.23,21.47 68.23,17.77 70,16 v70,9 | v86.7,8 86.7,7.42 86.84,7.28 86.84,4.58 86.75,4.38 X1.41
  Bottom 0.254: v43,9 45.07,9 45.73,9.66 46.27,9.66 46.93,9 v70,9 85.7,9 v86.7,8
VGHTOG  (via drill 0.35)
  Top 0.152: R26.2 71.3,21 v86,21 | v90.89,24 92.59,25.7 92.63,25.7 93.73,26.8 U1.28
  Bottom 0.152: v86,21 88.14,18.86 88.14,14.93 88.73,14.34 89.27,14.34 89.66,14.73 89.66,22.77 v90.89,24
VGL  (via drill 0.35)
  Top 0.254: X1.42 86.32,3.82 86.32,4.52 86.19,4.88 v86.19,7 | 45.5,9.5 v46,9 | 45.5,9.5 U4.3 | TP7.TP 29.52,4 33.59,8.06 36.94,8.06 36.99,8.12 44.12,8.12 45.5,9.5
  Bottom 0.254: v86.19,7 85.19,8 47,8 v46,9
VGLTOG  (via drill 0.35)
  Top 0.152: U1.26 104.56,24.96 104.09,24.96 97.13,18 v92,18 | 70,8.34 69.73,8.34 69.34,8.73 69.34,10.96 68.12,12.18 64.93,12.18 63.95,13.16 63.95,15.61 61.23,18.32 61.23,18.72 61.07,18.88 57.57,18.88 54.33,15.64 54.33,15.63 R28.1 | 70,8.34 70.27,8.34 | 70,8.34 70.27,8.34 | 70.27,8.34 70.66,8.73 70.66,9.27 70.5,9.43 70.5,11.5 71,12 v84,12
  Bottom 0.152: v84,12 89.14,12 92,14.87 v92,18
VNN
  Top 0.254: U$10.5 40.24,18.59 C14.1 | C14.1 40.56,16.09 U5.3 U5.2 | C14.1 38.33,16.68 33.18,16.68 23.5,7 20,7 TP4.TP
VPP
  Top 0.254: U$6.8 62.09,18.91 63,18 67.15,18 C7.1 | U$6.8 62.09,21.8 R16.1 | U$6.8 61.61,20.1 D3.3 57.8,21.8 | U$5.8 73.09,30.91 74,30 78.15,30 C5.1 80.21,31.36 AP2114H.P$3 81.96,31.18 | U$5.8 72.61,32.1 D2.3 63.7,32.1 62.68,31.08 | U$5.8 73.09,33.8 R13.1 | 45.09,25.5 45.09,24.91 46,24 50.15,24 C1.1 55.95,23.65 57.8,21.8 | 45.09,25.5 U$11.8 45.09,27.8 R10.1 | 45.09,25.5 44.49,26.1 D1.3 38.68,26.1 37.17,24.59 37.17,24.17 36.04,23.04 34.64,23.04 34.45,22.85 34.45,18.6 23.31,7.46 16.91,7.46 13.45,4 TP3.TP | 57.8,21.8 61.27,25.27 61.27,27.82 62,28.55 C20.1 62,30.4 D4.3 62.68,31.08 | R30.2 53.5,28.2 52.32,29.38 52.32,37.52 52.58,37.78 62.42,37.78 62.68,37.52 62.68,31.08
VS  (via drill 0.35)
  Top 0.152: v102.09,10 102.09,9.91 102.69,9.3 102.69,4.82 102.37,4.5 102.37,3.87 X1.10 | U1.48 91.29,31.51 91.29,28.28 92.36,27.21 v92.36,26.36
  Bottom 0.152: v92.36,26.36 92.36,19.73 v102.09,10
(copper drawn outside any net)
  shapes: Top area x1